# Altium schematic sheet [02] LDO and LiPo Circuit.SchDoc
size A4; SheetNumber: 2; SheetTotal: 6
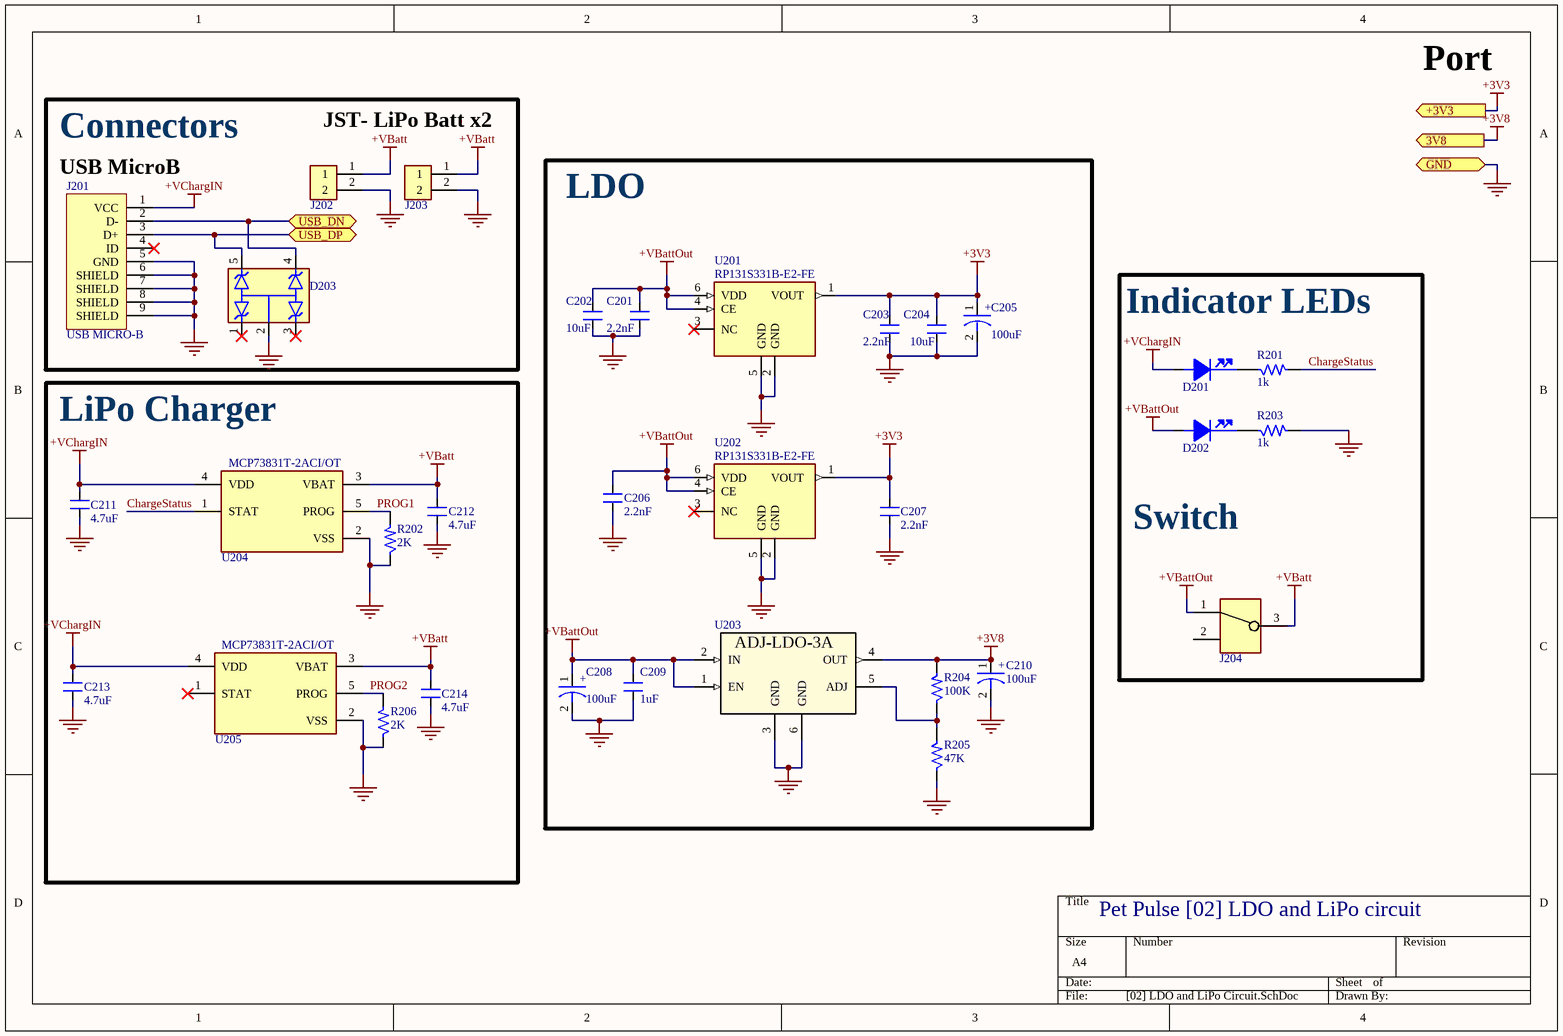
[diagram p0: [02] LDO and LiPo Circuit.SchDoc]

## Parts
C201  2.2nF  [CAP_0805]
C202  10uF  [CAP_1206]
C203  2.2nF  [CAP_0805]
C204  10uF  [CAP_1206]
C205  100uF  [ACAP_P236_D305_H303_RAD]
C206  2.2nF  [CAP_0805]
C207  2.2nF  [CAP_0805]
C208  100uF  [ACAP_P236_D305_H303_RAD]
C209  1uF  [CAP_0805]
C210  100uF  [ACAP_P236_D305_H303_RAD]
C211  4.7uF  [CAP_0805]
C212  4.7uF  [CAP_0805]
C213  4.7uF  [CAP_0805]
C214  4.7uF  [CAP_0805]
D201  LED 0805 ORANGE  [LED_0805]  (value not drawn)
D202  LED 0805 ORANGE  [LED_0805]  (value not drawn)
D203  ESDA6V1W5  [SOT-323-5]  (value not drawn)
J201  USB MICRO-B  [CON_USB2.0_MICROB-SMD]
J202  1x2 JST  [CON-JST-1X2-1.5-M-TH]  (value not drawn)
J203  1x2 JST  [CON-JST-1X2-1.5-M-TH]  (value not drawn)
J204  SW1_SlideSW_SMD_SPDT_450405020524  [SW1_SlideSW_SMD_SPDT_450405020524]  (value not drawn)
R201  1k  [RES_0805]
R202  2K  [RES_0805]
R203  1k  [RES_0805]
R204  100K  [RES_0805]
R205  47K  [RES_0805]
R206  2K  [RES_0805]
U201  RP131S331B-E2-FE  [6HSOP]
U202  RP131S331B-E2-FE  [6HSOP]
U203  MIC29302AWD  [TO-252-5_MCH]  (value not drawn)
U204  MCP73831T-2ACI/OT  [SOT-23-5_MC_MCH]
U205  MCP73831T-2ACI/OT  [SOT-23-5_MC_MCH]

## Blocks framed on the sheet
Connectors: D203 J201-J203
LDO: C201-C210 R204 R205 U201-U203
LiPo Charger: C211-C214 R202 R206 U204 U205

## Ports
3V8 (out, see [05] External Modules[4D], [06] LTE - A7670C[8A]), +3V3 (out, see [03] ESP32[2C], [04] GPS[4B], [05] External Modules[4C], [06] LTE - A7670C[8A]), GND (bidir, see [03] ESP32[2C], [04] GPS[4B], [05] External Modules[4D], [06] LTE - A7670C[8A]), USB_DN (bidir, see [03] ESP32[1D]), USB_DP (bidir, see [03] ESP32[1D])

## Nets
+3V3: C203.1 C204.2 C205.1 C207.1 U201.1(VOUT) U202.1(VOUT) ; port +3V3
+3V8: C210.1 R204.2 U203.4(OUT) ; port 3V8
+VBatt: C212.2 C214.2 J202.1 J203.1 J204.3 U204.3(VBAT) U205.3(VBAT)
+VBattOut: C201.1 C202.2 C206.1 C208.1 C209.2 D202.2(Anode) J204.1 U201.4(CE) U201.6(VDD) U202.4(CE) U202.6(VDD) U203.1(EN) U203.2(IN)
+VChargIN: C211.2 C213.2 D201.2(Anode) J201.1(VCC) U204.4(VDD) U205.4(VDD)
GND: C201.2 C202.1 C203.2 C204.1 C205.2 C206.2 C207.2 C208.2 C209.1 C210.2 C211.1 C212.1 C213.1 C214.1 D203.2 J201.5(GND) J201.6(SHIELD) J201.7(SHIELD) J201.8(SHIELD) J201.9(SHIELD) J202.2 J203.2 R202.1 R203.2 R205.1 R206.1 U201.2(GND) U201.5(GND) U202.2(GND) U202.5(GND) U203.3(GND) U203.6(GND) U204.2(VSS) U205.2(VSS) ; port GND
ChargeStatus: R201.2 U204.1(STAT)
PROG1: R202.2 U204.5(PROG)
PROG2: R206.2 U205.5(PROG)
USB_DN: D203.4 J201.2(D-) ; port USB_DN
USB_DP: D203.5 J201.3(D+) ; port USB_DP
NetD201_1: D201.1(Cathode) R201.1
NetD202_1: D202.1(Cathode) R203.1
NetR204_1: R204.1 R205.2 U203.5(ADJ)

Not connected (* = marked no-connect by the designer): D203 1* 3*; J201 4(ID)*; J204 2; U201 3(NC)*; U202 3(NC)*; U205 1(STAT)*

## Notes on the sheet
- Port
- (near J201) USB MicroB
- JST- LiPo Batt x2
- Indicator LEDs
- Switch
- Pet Pulse [02] LDO and LiPo circuit
- (in symbol CAP-P_100uF-25V-20%-RAD) +
- (in symbol REG_LDO_ADJ_3A_MIC29302AWD) ADJ-LDO-3A

## Library data of the parts
C201 C203 C206 C207 = CAP_2.2nF-50V-10%-0805: 2200pF ±10% 50V Ceramic Capacitor C0G, NP0 0805 (2012 Metric); Manufacturer: YAGEO; Manufacturer Part Number: CC0805KRX7R9BB222; Alternate Part Number-1: NA; Case/Package: 0805
C202 C204 = CAP_10uF-50V-10%-1206: 10µF ±10% 50V Ceramic Capacitor X7R 1206 (3216 Metric); Manufacturer: KEMET; Manufacturer Part Number: CL31B106KBHNNNE; Alternate Part Number-1: GRT31CR61H106ME01L; Case/Package: 1206; Supplier-1: SIRICOM; Supplier Part Number-1: CC1206KKX5R9BB106
C205 C208 C210 = CAP-P_100uF-25V-20%-RAD: 100µF 25V Aluminum Electrolytic Capacitors Radial, Can - SMD 1000 Hrs @ 105°C; Manufacturer: Nichicon; Manufacturer Part Number: UWT1E101MCL1GS; Alternate Part Number-1: NA; Case/Package: Radial-SMD; Supplier-1: SP ROAD; Supplier Part Number-1: UWT1E101MCL1GS
C209 = CAP_1uF-50V-5%-0805: 1µF ±5% 50V Ceramic Capacitor X7R 0805 (2012 Metric); Manufacturer: Samsung; Manufacturer Part Number: CC0805JKX7R9BB105; Alternate Part Number-1: 0805F105M500NT; Case/Package: 0805; Supplier-1: SIRICOM; Supplier Part Number-1: CL21B105KBFNNNE
C211-C214 = CAP_4.7uF-50V-10%-0805: 4.7µF ±10% 50V Ceramic Capacitor X5R 0805 (2012 Metric); Manufacturer: Yageo; Manufacturer Part Number: GRM21BR61H475KE51L; Alternate Part Number-1: NA; Case/Package: 0805; Supplier-1: SIRICOM; Supplier Part Number-1: CL21A475KBQNNNE
D201 D202 = LED_ORANGE-2V-20mA- 0805: Orange LED 0805 Vf = 2V, 20mA; Manufacturer: Osram Opto; Manufacturer Part Number: LOR976-PS-1; Lens Color: White; Viewing Angle: 160°; Lens Style: Flat,Rectangular,Diffused,Colorless; Forward Current: 25mA; Luminous Intensity: 162.5mcd; Dominant Wavelength: 606nm; Luminous Flux: 0.735lm; Reverse Voltage: 12V; Lens Transparency: Diffused; Number of LEDs: 1; Lens Size: 1.25mm; Supplier 1: Arrow Electronics; RoHS: Yes; Category: LEDs; Stock 1: 2418; Pricing 1: 1=0.27100, 10=0.15400, 25=0.15270, 100=0.07290, 250=0.07210, 500=0.06600, 1000=0.05150 (USD); Mount: Surface Mount; Case/Package: 0805; Number of Pins: 2; Color: Orange; Case Code (Metric): 2012; Case Code (Imperial): 0805; Contact Plating: Tin,Matte; Min Operating Temperature: -30°C; Max Operating Temperature: 85°C; Packaging: Tape and Reel; Forward Voltage: 2V; Test Current: 20mA; Package Quantity: 16000; Illumination Color: Orange; Series: CHIPLED 0805; Length: 2mm; Width: 1.25mm; Height: 0.9mm; Radiation Hardening: No; RoHS Compliant: Yes; ComponentLink1URL: https://datasheet.ciiva.com/2119/00078881-0-2119287.pdf?src-supplier=Digi-Key; ComponentLink1Description: https://datasheet.ciiva.com/2119/00078881-0-2119287.pdf?src-supplier=Digi-Key; ComponentLink2URL: https://datasheet.ciiva.com/2119/00078881-0-2119286.pdf?src-supplier=Digi-Key; ComponentLink2Description: https://datasheet.ciiva.com/2119/00078881-0-2119286.pdf?src-supplier=Digi-Key; ComponentLink3URL: https://datasheet.ciiva.com/2119/00078881-0-2119288.pdf?src-supplier=Digi-Key; ComponentLink3Description: https://datasheet.ciiva.com/2119/00078881-0-2119288.pdf?src-supplier=Digi-Key; Supplier Part Number 1: LO R976-PS-1
D203 = DIO_TVS_ARRY_3Vrm_6.1Vbr_ESDA6V1W5: Tvs Diode Array 3V reverse standoff, 6.1V reverse breakdown.  SOT-323-5; Manufacturer: STMicroelectronics; Manufacturer Part Number: ESDA6V1W5; Case/Package: SOT-323-5
J201 = CON_USB2.0_MICROB-SMD: USB - micro B USB 2.0 Receptacle Connector 5 Position Surface Mount, Right Angle; Manufacturer: ICC; Manufacturer Part Number: 10118192-0001LF; Alternate Part Number-1: NA; Case/Package: USB MICRO-B SMD; Supplier-1: SUNROM; Supplier Part Number-1: MICRO USB
J202 J203 = CON-JST-1X2-1.5-M-TH: Connector Header Through Hole 2 position 0.059" (1.50mm); Manufacturer: JST Sales America Inc.; Manufacturer Part Number: B2B-ZR (LF)(SN); Supplier 1: Digi-Key; Category: Headers and Wire Housings; Supplier Part Number 1: 455-B2B-ZR-ND; ComponentLink1Description: DigiKey; ComponentLink1URL: https://www.digikey.in/en/products/detail/jst-sales-america-inc/B2B-ZR/926564
J204 = SW1_SlideSW_SMD_SPDT_450405020524: Slide Switch SPDT Surface Mount; Manufacturer: Würth Elektronik; Manufacturer Part Number: 450405020524; Case/Package: SMT
R201 R203 = RES_1K- 0.125W-5%-0805: RES 1K OHM 5% 1/8W 0805; Manufacturer Part Number: RC0805JR-131KL; Manufacturer: YAGEO; Alternate Part Number: NA; Case/Package: 0805
R202 R206 = RES_2K-0.125W-1%-0805: 2 kOhms ±1% 0.125W, 1/8W Chip Resistor 0805 (2012 Metric) Moisture Resistant Thick Film; Manufacturer: TE Connectivity; Manufacturer Part Number: RC0805FR-072KL; Alternate Part Number-1: NA; Case/Package: 0805; Supplier-1: SIRICOM; Supplier Part Number-1: WR08X2001FTL
R204 = RES_100K-0.125W-1%-0805: 100 kOhms ±1% 0.125W, 1/8W Chip Resistor 0805 (2012 Metric) Automotive AEC-Q200 Thick Film; Manufacturer: Walsin; Manufacturer Part Number: WR08X1003FTL; Alternate Part Number-1: NA; Case/Package: 0805; Supplier-1: SIRICOM; Supplier Part Number-1: WR08X1003FTL
R205 = RES_47K-0.125W-1%-0805: 47 kOhms ±1% 0.125W, 1/8W Chip Resistor 0805 (2012 Metric) Moisture Resistant Thick Film; Manufacturer: YAGEO; Manufacturer Part Number: RC0805FR-0747KL; Case/Package: 0805
U201 U202 = REG_LDO_3.3V_1A_RP131S331B-E2-FE: LDO 3.3V Output 1A 6-HSOP-J; Manufacturer: Nisshinbo Micro Devices Inc.; Manufacturer Part Number: RP131S331B-E2-FE; Case/Package: 6HSOP
U203 = REG_LDO_ADJ_3A_MIC29302AWD: Linear Voltage Regulator IC Positive Adjustable 1 Output 3A TO-252-5; Microchip Technology: Microchip; Manufacturer Part Number: MIC29302AWD; Case/Package: TO-252-5
U204 U205 = IC_BATT_CNTL_LI-ION-1CELL: Charger IC Lithium Ion/Polymer SOT-23-5; Manufacturer: Microchip; Manufacturer Part Number: MCP73831T-2ACI/OT; Case/Package: SOT-23-5